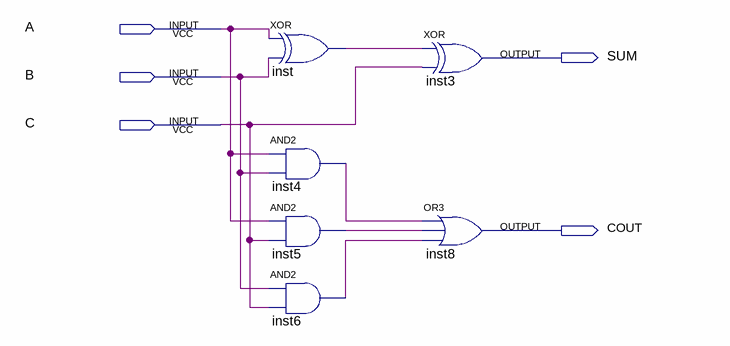
[diagram p0: schematic sheet]
// Quartus schematic fullAdder.bdf as structural Verilog: 6 symbols, 5 pins
module fullAdder (
  input  A,
  input  B,
  input  C,
  output SUM,
  output COUT
);

  wire inst4_out, inst5_out, inst6_out, inst_out;

  xor inst (inst_out, A, B);
  and inst4 (inst4_out, A, B);
  and inst5 (inst5_out, A, C);
  and inst6 (inst6_out, B, C);
  xor inst3 (SUM, inst_out, C);
  or inst8 (COUT, inst4_out, inst5_out, inst6_out);
endmodule
